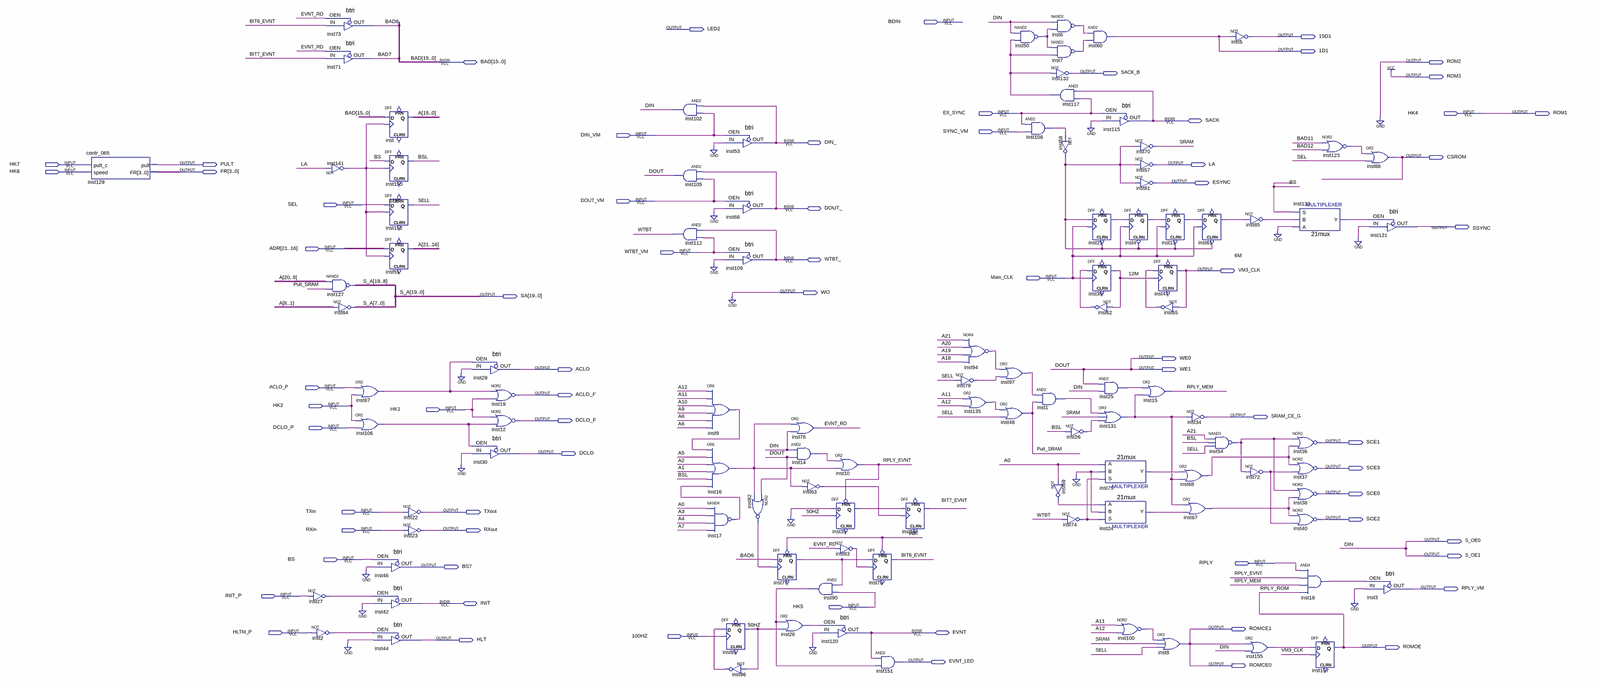
[diagram p0: schematic sheet, whole]
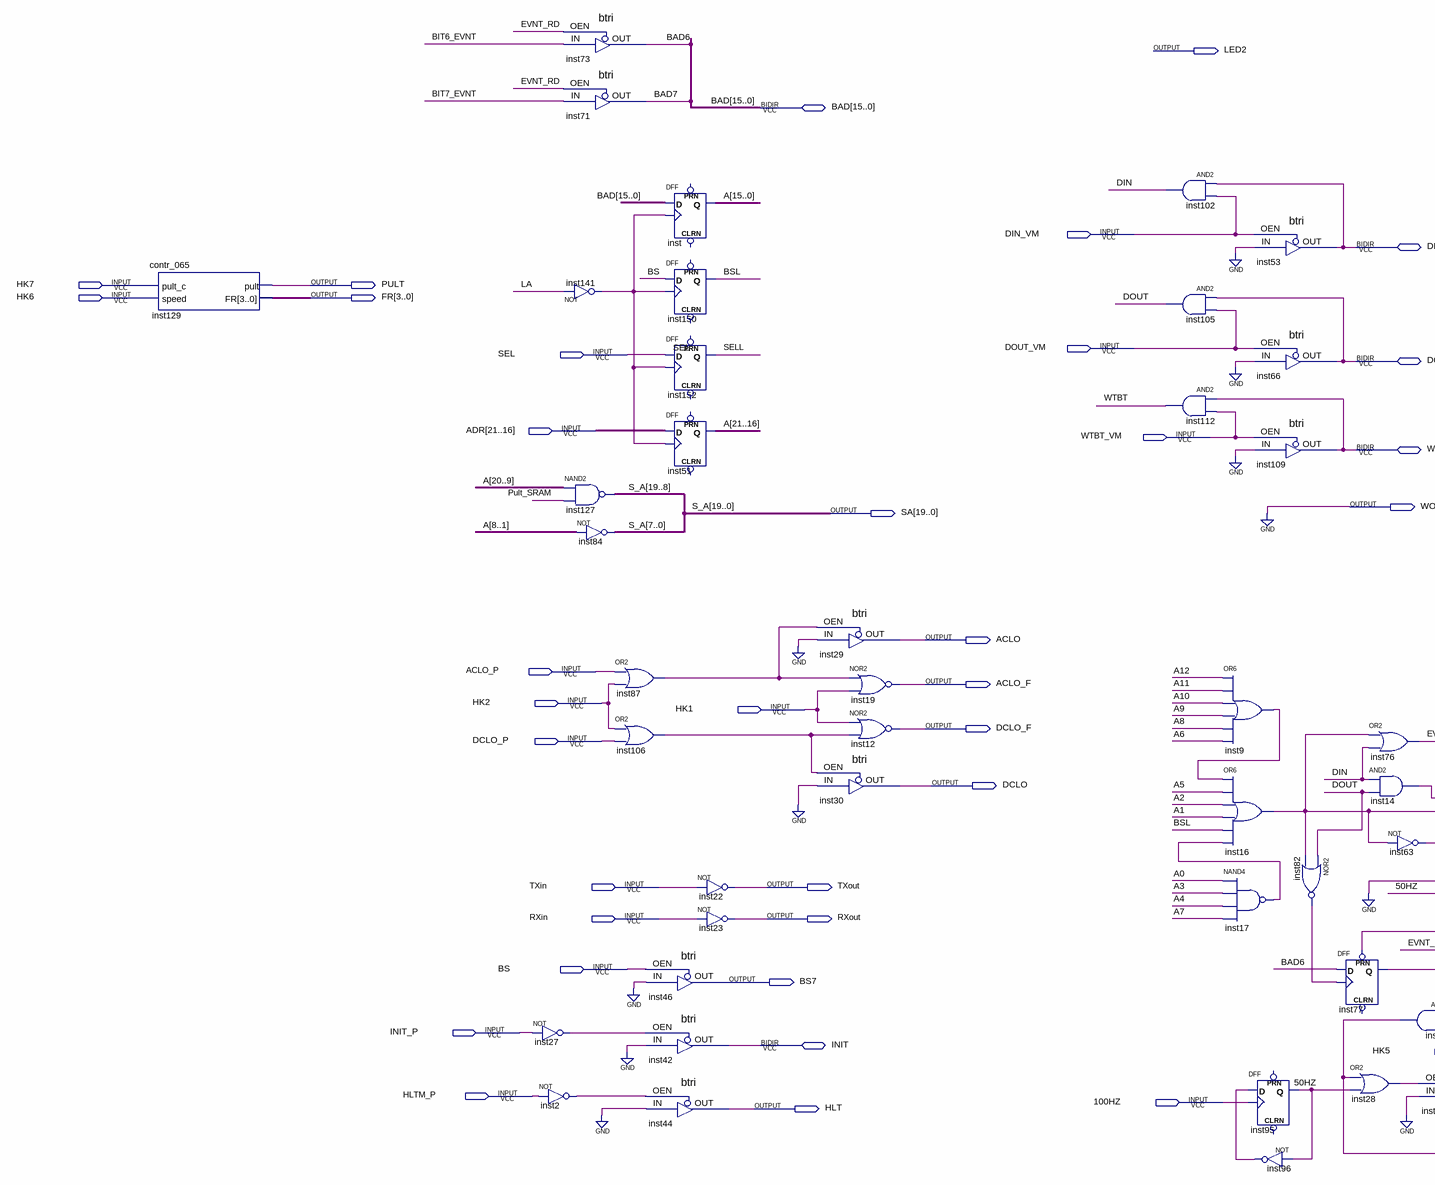
[diagram p1: schematic sheet, left part]
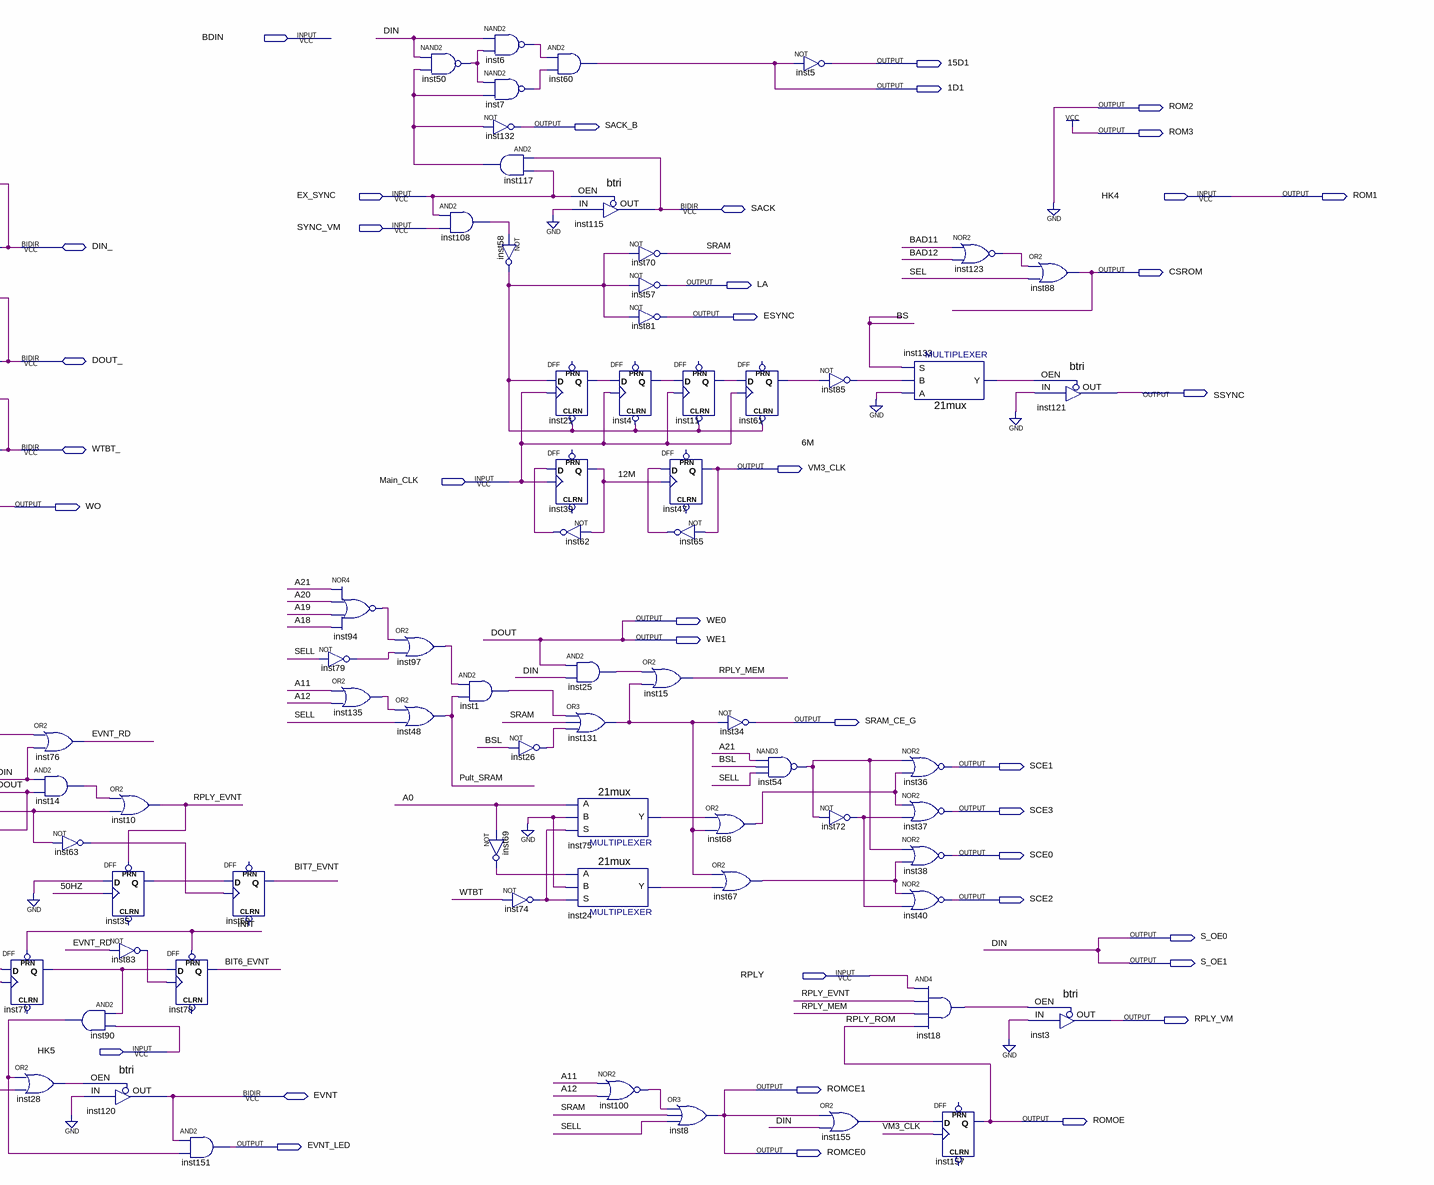
[diagram p2: schematic sheet, right part]
// Quartus schematic 1201_2016.bdf as structural Verilog: 103 symbols, 69 pins
module \1201_2016  (
  input  BDIN,
  input  EX_SYNC,
  input  HK4,
  input  SYNC_VM,
  input  DIN_VM,
  input  HK7,
  input  HK6,
  input  DOUT_VM,
  input  SEL,
  input  [21:16] ADR,
  input  WTBT_VM,
  input  Main_CLK,
  input  ACLO_P,
  input  HK2,
  input  HK1,
  input  DCLO_P,
  input  TXin,
  input  RXin,
  input  BS,
  input  RPLY,
  input  INIT_P,
  input  HK5,
  input  HLTM_P,
  input  \100HZ ,
  inout  [15:0] BAD,
  inout  SACK,
  inout  DIN_,
  inout  DOUT_,
  inout  WTBT_,
  inout  INIT,
  inout  EVNT,
  output LED2,
  output \15D1 ,
  output \1D1 ,
  output ROM2,
  output SACK_B,
  output ROM3,
  output ROM1,
  output CSROM,
  output PULT,
  output LA,
  output [3:0] FR,
  output ESYNC,
  output SSYNC,
  output VM3_CLK,
  output WO,
  output [19:0] SA,
  output WE0,
  output ACLO,
  output WE1,
  output ACLO_F,
  output SRAM_CE_G,
  output DCLO_F,
  output SCE1,
  output DCLO,
  output SCE3,
  output SCE0,
  output TXout,
  output SCE2,
  output RXout,
  output S_OE0,
  output S_OE1,
  output BS7,
  output RPLY_VM,
  output ROMCE1,
  output HLT,
  output ROMOE,
  output EVNT_LED,
  output ROMCE0
);

  wire \12M , \50HZ , BIT6_EVNT, BIT7_EVNT, BSL, EVNT_RD, inst1_out, inst2_out, inst4_q, inst6_out,
       inst7_out, inst9_out, inst11_q, inst14_out, inst16_out, inst17_out, inst18_out, inst21_q, inst24_y,
       inst25_out, inst26_out, inst27_out, inst28_out, inst35_q, inst50_out, inst54_out, inst58_out,
       inst61_q, inst62_out, inst63_out, inst65_out, inst67_out, inst68_out, inst69_out, inst72_out,
       inst74_out, inst75_y, inst77_q, inst79_out, inst82_out, inst83_out, inst85_out, inst87_out,
       inst90_out, inst94_out, inst96_out, inst97_out, inst100_out, inst106_out, inst108_out, inst117_out,
       inst123_out, inst131_out, inst133_y, inst135_out, inst141_out, inst155_out, Pult_SRAM, RPLY_EVNT,
       RPLY_MEM, SELL, SRAM, WTBT;
  wire [21:0] A;

  contr_065 inst129 (.pult_c(HK7), .speed(HK6), .pult(PULT), .FR(FR));
  not inst27 (inst27_out, INIT_P);
  not inst2 (inst2_out, HLTM_P);
  btri inst73 (.OEN(EVNT_RD), .IN(BIT6_EVNT), .OUT(BAD[6]));
  btri inst71 (.OEN(EVNT_RD), .IN(BIT7_EVNT), .OUT(BAD[7]));
  not inst141 (inst141_out, LA);
  assign SA[19:8] = ~(A[20:9] & {12{Pult_SRAM}});  // NAND2 inst127, 12 bits wide
  assign SA[7:0] = ~A[8:1];  // NOT inst84, 8 bits wide
  or inst87 (inst87_out, ACLO_P, HK2);
  or inst106 (inst106_out, HK2, DCLO_P);
  btri inst46 (.OEN(BS), .IN(1'b0), .OUT(BS7));
  btri inst42 (.OEN(inst27_out), .IN(1'b0), .OUT(INIT));
  btri inst44 (.OEN(inst2_out), .IN(1'b0), .OUT(HLT));
  DFF inst[15:0] (.CLK(inst141_out), .D(BAD), .Q(A[15:0]));  // open: CLRN, PRN
  DFF inst150 (.CLK(inst141_out), .D(BS), .Q(BSL));  // open: CLRN, PRN
  DFF inst152 (.CLK(inst141_out), .D(SEL), .Q(SELL));  // open: CLRN, PRN
  DFF inst51[5:0] (.CLK(inst141_out), .D(ADR), .Q(A[21:16]));  // open: CLRN, PRN
  not inst22 (TXout, TXin);
  not inst23 (RXout, RXin);
  btri inst29 (.OEN(inst87_out), .IN(1'b0), .OUT(ACLO));
  nor inst19 (ACLO_F, inst87_out, HK1);
  nor inst12 (DCLO_F, HK1, inst106_out);
  btri inst30 (.OEN(inst106_out), .IN(1'b0), .OUT(DCLO));
  and inst102 (S_OE0, DIN_, DIN_VM);
  and inst105 (WE0, DOUT_, DOUT_VM);
  and inst112 (WTBT, WTBT_, WTBT_VM);
  btri inst53 (.OEN(DIN_VM), .IN(1'b0), .OUT(DIN_));
  btri inst66 (.OEN(DOUT_VM), .IN(1'b0), .OUT(DOUT_));
  btri inst109 (.OEN(WTBT_VM), .IN(1'b0), .OUT(WTBT_));
  or inst9 (inst9_out, A[12], A[11], A[10], A[9], A[8], A[6]);
  or inst16 (inst16_out, inst9_out, A[5], A[2], A[1], BSL, inst17_out);
  nand inst17 (inst17_out, A[0], A[3], A[4], A[7]);
  DFF inst95 (.CLK(\100HZ ), .D(inst96_out), .Q(\50HZ ));  // open: CLRN, PRN
  not inst96 (inst96_out, \50HZ );
  nor inst82 (inst82_out, WE0, inst16_out);
  or inst76 (EVNT_RD, inst16_out, S_OE0);
  and inst14 (inst14_out, S_OE0, WE0);
  DFF inst77 (.CLK(inst82_out), .D(BAD[6]), .PRN(INIT), .Q(inst77_q));  // open: CLRN
  or inst28 (inst28_out, inst90_out, \50HZ );
  not inst63 (inst63_out, inst16_out);
  and inst90 (inst90_out, inst77_q, HK5);
  btri inst120 (.OEN(inst28_out), .IN(1'b0), .OUT(EVNT));
  or inst10 (RPLY_EVNT, inst14_out, inst16_out);
  DFF inst35 (.CLK(\50HZ ), .D(1'b0), .PRN(RPLY_EVNT), .Q(inst35_q));  // open: CLRN
  not inst83 (inst83_out, EVNT_RD);
  DFF inst78 (.CLK(inst83_out), .D(inst77_q), .PRN(INIT), .Q(BIT6_EVNT));  // open: CLRN
  and inst151 (EVNT_LED, EVNT, inst90_out);
  DFF inst59 (.CLK(inst63_out), .D(inst35_q), .Q(BIT7_EVNT));  // open: CLRN, PRN
  nor inst94 (inst94_out, A[21], A[20], A[19], A[18]);
  not inst79 (inst79_out, SELL);
  or inst135 (inst135_out, A[11], A[12]);
  nand inst50 (inst50_out, S_OE0, inst117_out);
  and inst108 (inst108_out, EX_SYNC, SYNC_VM);
  or inst97 (inst97_out, inst94_out, inst79_out);
  or inst48 (Pult_SRAM, inst135_out, SELL);
  nand inst6 (inst6_out, S_OE0, inst50_out);
  nand inst7 (inst7_out, inst50_out, inst117_out);
  not inst132 (SACK_B, inst117_out);
  and inst117 (inst117_out, SACK, EX_SYNC);
  and inst1 (inst1_out, inst97_out, Pult_SRAM);
  not inst69 (inst69_out, A[0]);
  not inst58 (inst58_out, inst108_out);
  not inst26 (inst26_out, BSL);
  not inst74 (inst74_out, WTBT);
  and inst60 (\1D1 , inst6_out, inst7_out);
  btri inst115 (.OEN(EX_SYNC), .IN(1'b0), .OUT(SACK));
  DFF inst21 (.CLRN(inst58_out), .CLK(Main_CLK), .D(inst58_out), .Q(inst21_q));  // open: PRN
  DFF inst39 (.CLK(Main_CLK), .D(inst62_out), .Q(\12M ));  // open: CLRN, PRN
  not inst62 (inst62_out, \12M );
  and inst25 (inst25_out, WE0, S_OE0);
  or inst131 (inst131_out, inst1_out, SRAM, inst26_out);
  \21mux  inst75 (.S(inst74_out), .B(1'b0), .A(A[0]), .Y(inst75_y));
  \21mux  inst24 (.S(inst74_out), .B(1'b0), .A(inst69_out), .Y(inst24_y));
  not inst70 (SRAM, inst58_out);
  not inst57 (LA, inst58_out);
  not inst81 (ESYNC, inst58_out);
  DFF inst4 (.CLRN(inst58_out), .CLK(Main_CLK), .D(inst21_q), .Q(inst4_q));  // open: PRN
  or inst15 (RPLY_MEM, inst25_out, inst131_out);
  nor inst100 (inst100_out, A[11], A[12]);
  DFF inst11 (.CLRN(inst58_out), .CLK(Main_CLK), .D(inst4_q), .Q(inst11_q));  // open: PRN
  DFF inst47 (.CLK(\12M ), .D(inst65_out), .Q(VM3_CLK));  // open: CLRN, PRN
  not inst65 (inst65_out, VM3_CLK);
  or inst8 (ROMCE0, inst100_out, SRAM, SELL);
  DFF inst61 (.CLRN(inst58_out), .CLK(Main_CLK), .D(inst11_q), .Q(inst61_q));  // open: PRN
  not inst34 (SRAM_CE_G, inst131_out);
  or inst68 (inst68_out, inst75_y, inst131_out);
  or inst67 (inst67_out, inst131_out, inst24_y);
  not inst5 (\15D1 , \1D1 );
  nand inst54 (inst54_out, A[21], BSL, SELL);
  not inst85 (inst85_out, inst61_q);
  not inst72 (inst72_out, inst54_out);
  or inst155 (inst155_out, ROMCE0, S_OE0);
  \21mux  inst133 (.S(BS), .B(inst85_out), .A(1'b0), .Y(inst133_y));
  nor inst36 (SCE1, inst54_out, inst68_out);
  nor inst37 (SCE3, inst68_out, inst72_out);
  nor inst38 (SCE0, inst54_out, inst67_out);
  nor inst40 (SCE2, inst67_out, inst72_out);
  and inst18 (inst18_out, RPLY, RPLY_EVNT, RPLY_MEM, ROMOE);
  DFF inst157 (.CLK(VM3_CLK), .D(inst155_out), .Q(ROMOE));  // open: CLRN, PRN
  nor inst123 (inst123_out, BAD[11], BAD[12]);
  or inst88 (CSROM, inst123_out, SEL);
  btri inst121 (.OEN(inst133_y), .IN(1'b0), .OUT(SSYNC));
  btri inst3 (.OEN(inst18_out), .IN(1'b0), .OUT(RPLY_VM));

  assign ROM1 = HK4;
  assign ROM2 = 1'b0;
  assign ROM3 = 1'b1;
  assign ROMCE1 = ROMCE0;
  assign S_OE1 = S_OE0;
  assign WE1 = WE0;
  assign WO = 1'b0;

  // Other names for the same wires on the sheet: 6M = VM3_CLK; DIN = S_OE0; DOUT = WE0; RPLY_ROM = ROMOE;
  //   S_A[19:0] = SA
endmodule
